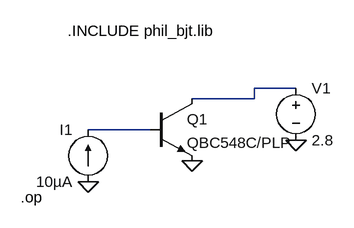
[diagram p0: schematic tbjphillips(hfe).asc]
tbjphillips(hfe).asc, the LTspice schematic file:
Version 4
SHEET 1 880 680
WIRE 352 112 288 112
WIRE 288 128 288 112
WIRE 288 128 192 128
WIRE 128 176 32 176
FLAG 192 224 0
FLAG 352 192 0
FLAG 32 256 0
SYMBOL npn 128 128 R0
SYMATTR InstName Q1
SYMATTR Value QBC548C/PLP
SYMBOL voltage 352 96 R0
WINDOW 123 0 0 Left 2
WINDOW 39 0 0 Left 2
SYMATTR InstName V1
SYMATTR Value 2.8
SYMBOL current 32 256 R180
WINDOW 0 24 80 Left 2
WINDOW 3 24 0 Left 2
SYMATTR InstName I1
SYMATTR Value 10µA
TEXT 0 24 Left 2 !.INCLUDE phil_bjt.lib
TEXT -72 280 Left 2 !.op

The netlist it stands for:
* tbjphillips(hfe).asc
Q1 N001 N002 0 0 QBC548C/PLP
V1 N001 0 2.8
I1 0 N002 10µA
.model NPN NPN
.model PNP PNP
.lib standard.bjt
.INCLUDE phil_bjt.lib
.op
.backanno
.end